# EAGLE schematic M1502C (EAGLE 6.6.0)
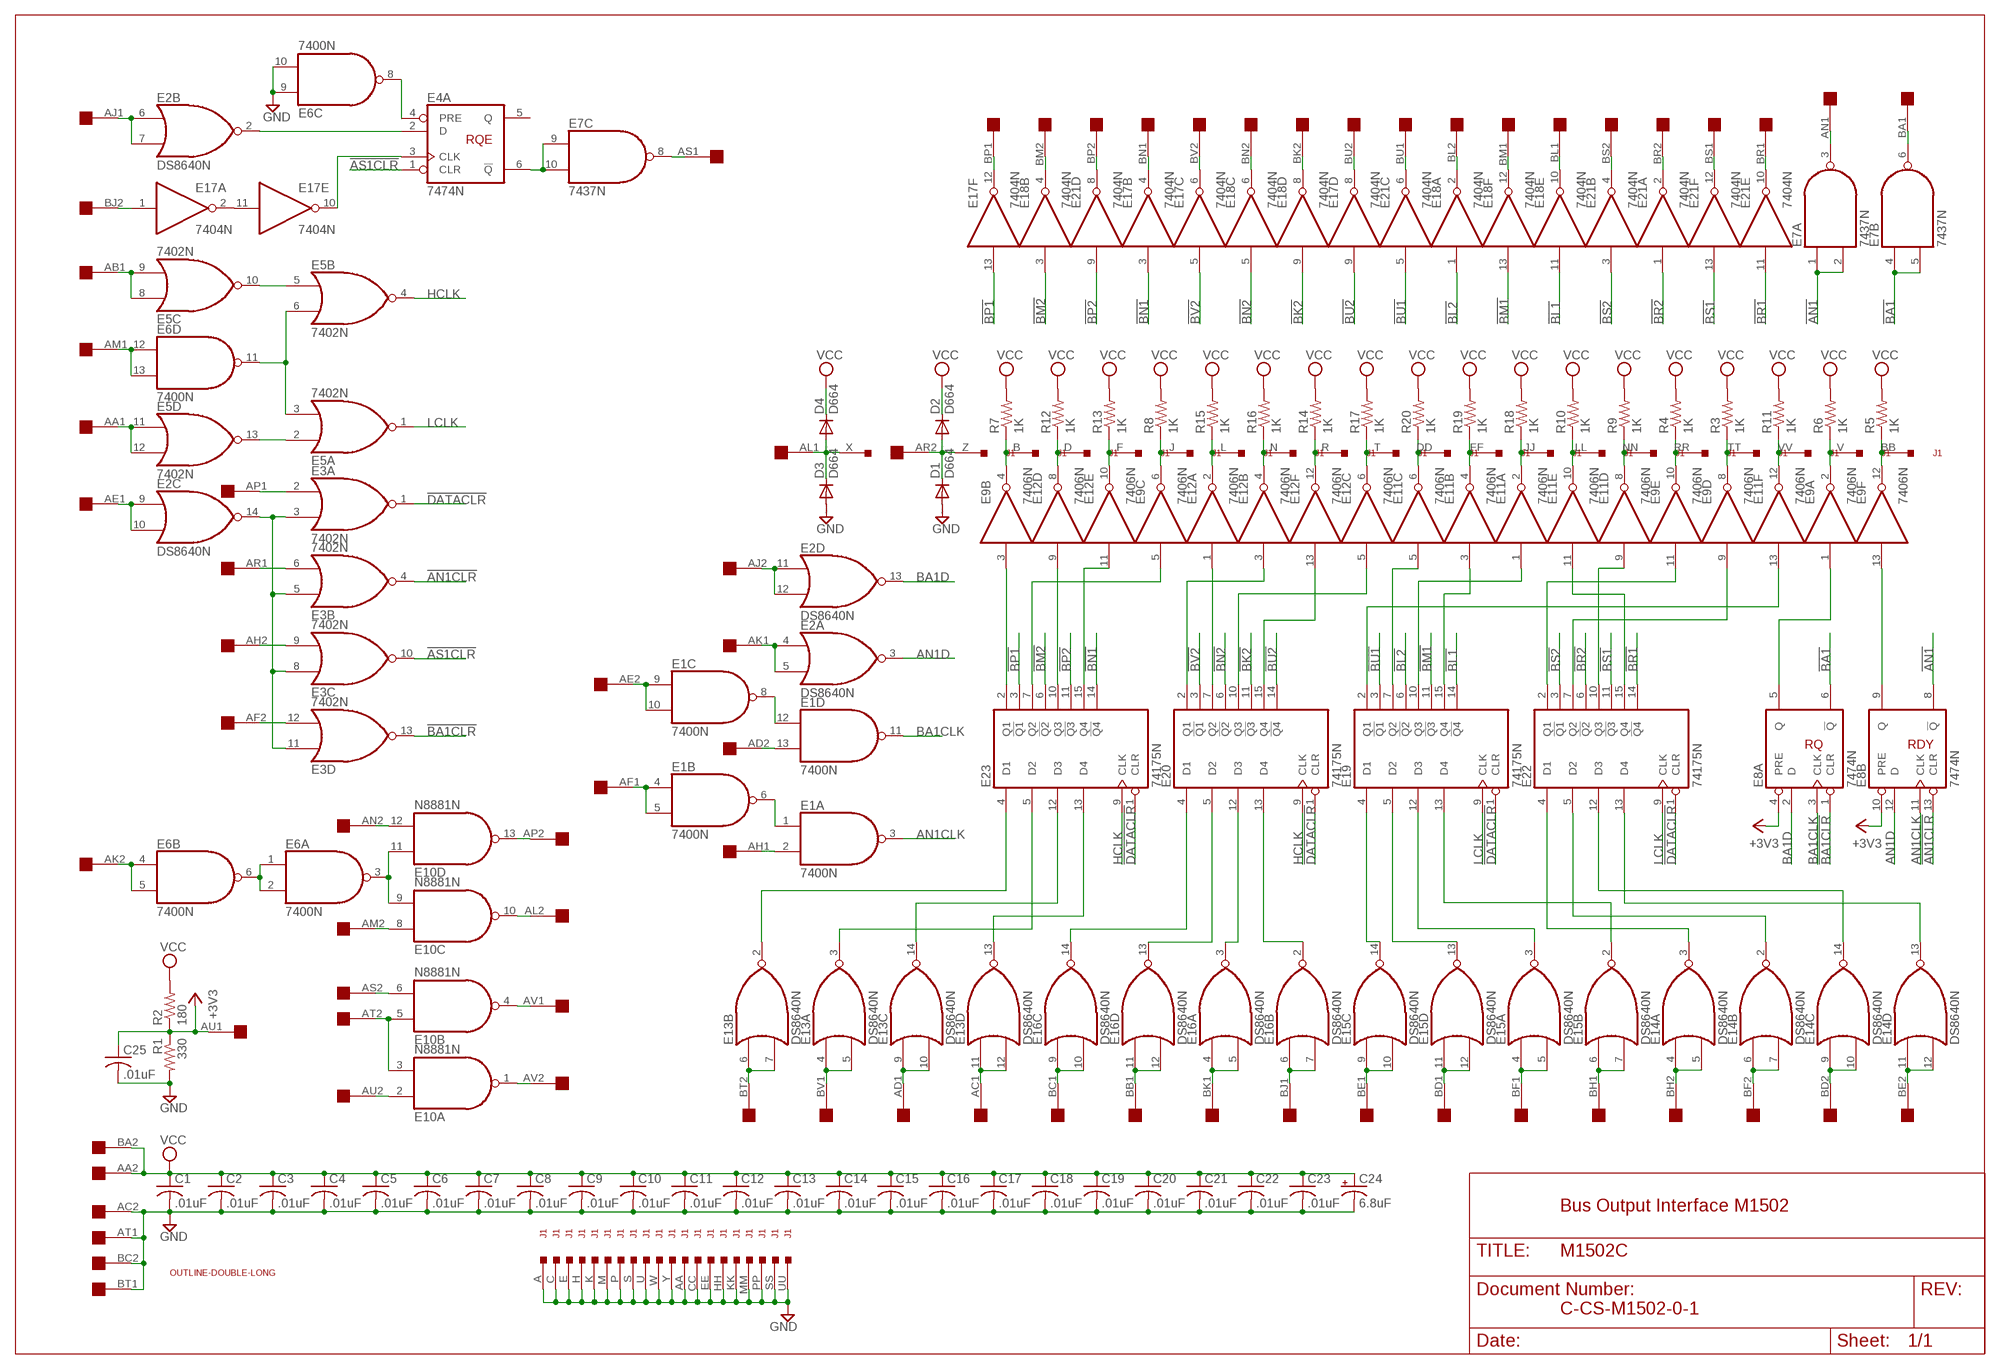
[diagram p0: schematic, sheet 1]

## Parts
C1  .01uF  C-US075-032X103  [C075-032X103]
C2  .01uF  C-US075-032X103  [C075-032X103]
C3  .01uF  C-US075-032X103  [C075-032X103]
C4  .01uF  C-US075-032X103  [C075-032X103]
C5  .01uF  C-US075-032X103  [C075-032X103]
C6  .01uF  C-US075-032X103  [C075-032X103]
C7  .01uF  C-US075-032X103  [C075-032X103]
C8  .01uF  C-US075-032X103  [C075-032X103]
C9  .01uF  C-US075-032X103  [C075-032X103]
C10  .01uF  C-US075-032X103  [C075-032X103]
C11  .01uF  C-US075-032X103  [C075-032X103]
C12  .01uF  C-US075-032X103  [C075-032X103]
C13  .01uF  C-US075-032X103  [C075-032X103]
C14  .01uF  C-US075-032X103  [C075-032X103]
C15  .01uF  C-US075-032X103  [C075-032X103]
C16  .01uF  C-US075-032X103  [C075-032X103]
C17  .01uF  C-US075-032X103  [C075-032X103]
C18  .01uF  C-US075-032X103  [C075-032X103]
C19  .01uF  C-US075-032X103  [C075-032X103]
C20  .01uF  C-US075-032X103  [C075-032X103]
C21  .01uF  C-US075-032X103  [C075-032X103]
C22  .01uF  C-US075-032X103  [C075-032X103]
C23  .01uF  C-US075-032X103  [C075-032X103]
C24  6.8uF  CPOL-USE20-8AXIAL  [E12-8]
C25  .01uF  C-US075-032X103  [C075-032X103]
D1  D664  DIODE-DO35-10  [DO35-10]
D2  D664  DIODE-DO35-10  [DO35-10]
D3  D664  DIODE-DO35-10  [DO35-10]
D4  D664  DIODE-DO35-10  [DO35-10]
E1  7400N  [DIL14]
E2  DS8640N  [DIL14]
E3  7402N  [DIL14]
E4  7474N  74S74N  [DIL14]
E5  7402N  [DIL14]
E6  7400N  [DIL14]
E7  7437N  [DIL14]
E8  7474N  74S74N  [DIL14]
E9  7406N  [DIL14]
E10  N8881N  [DIL14]
E11  7406N  [DIL14]
E12  7406N  [DIL14]
E13  DS8640N  [DIL14]
E14  DS8640N  [DIL14]
E15  DS8640N  [DIL14]
E16  DS8640N  [DIL14]
E17  7404N  [DIL14]
E18  7404N  [DIL14]
E19  74175N  [DIL16]
E20  74175N  [DIL16]
E21  7404N  [DIL14]
E22  74175N  [DIL16]
E23  74175N  [DIL16]
J1  DEC40PINSH  [DEC40PINH]
R1  330  R-US_0207/10  [0207/10]
R2  180  R-US_0207/10  [0207/10]
R3  1K  R-US_0207/10  [0207/10]
R4  1K  R-US_0207/10  [0207/10]
R5  1K  R-US_0207/10  [0207/10]
R6  1K  R-US_0207/10  [0207/10]
R7  1K  R-US_0207/10  [0207/10]
R8  1K  R-US_0207/10  [0207/10]
R9  1K  R-US_0207/10  [0207/10]
R10  1K  R-US_0207/10  [0207/10]
R11  1K  R-US_0207/10  [0207/10]
R12  1K  R-US_0207/10  [0207/10]
R13  1K  R-US_0207/10  [0207/10]
R14  1K  R-US_0207/10  [0207/10]
R15  1K  R-US_0207/10  [0207/10]
R16  1K  R-US_0207/10  [0207/10]
R17  1K  R-US_0207/10  [0207/10]
R18  1K  R-US_0207/10  [0207/10]
R19  1K  R-US_0207/10  [0207/10]
R20  1K  R-US_0207/10  [0207/10]
U$1  OUTLINE-DOUBLE-LONG  [DOUBLE-LONG]
U$3  DOUBLE  [EDGE-CON4]

## Nets
!AN1: E7.1(A:I0) E7.2(A:I1) E8.8(B:!Q)
!AN1CLR: E3.4(B:O) E8.13(B:CLR)
!AS1CLR: E3.10(C:O) E4.1(A:CLR)
!BA1: E7.4(B:I0) E7.5(B:I1) E8.6(A:!Q)
!BA1CLR: E3.13(D:O) E8.1(A:CLR)
!BK2: E18.9(D:I) E20.11(!Q3)
!BL1: E18.11(E:I) E19.14(!Q4)
!BL2: E18.1(A:I) E19.6(!Q2)
!BM1: E18.13(F:I) E19.11(!Q3)
!BM2: E18.3(B:I) E23.6(!Q2)
!BN1: E17.3(B:I) E23.14(!Q4)
!BN2: E18.5(C:I) E20.6(!Q2)
!BP1: E17.13(F:I) E23.3(!Q1)
!BP2: E21.9(D:I) E23.11(!Q3)
!BR1: E21.11(E:I) E22.14(!Q4)
!BR2: E21.1(A:I) E22.6(!Q2)
!BS1: E21.13(F:I) E22.11(!Q3)
!BS2: E21.3(B:I) E22.3(!Q1)
!BU1: E19.3(!Q1) E21.5(C:I)
!BU2: E17.9(D:I) E20.14(!Q4)
!BV2: E17.5(C:I) E20.3(!Q1)
!DATACLR: E3.1(A:O) E19.1(CLR) E20.1(CLR) E22.1(CLR) E23.1(CLR)
+3V: E4.4(A:PRE) E6.8(C:O)
+3V3 [supply]: C25.1 E8.4(A:PRE) E8.10(B:PRE) R1.1 R2.1 U$3.AU1
AA1: E5.11(D:I0) E5.12(D:I1) U$3.AA1
AB1: E5.8(C:I0) E5.9(C:I1) U$3.AB1
AC1: E13.11(D:I0) E13.12(D:I1) U$3.AC1
AD1: E13.9(C:I0) E13.10(C:I1) U$3.AD1
AD2: E1.13(D:I1) U$3.AD2
AE1: E2.9(C:I0) E2.10(C:I1) U$3.AE1
AE2: E1.9(C:I0) E1.10(C:I1) U$3.AE2
AF1: E1.4(B:I0) E1.5(B:I1) U$3.AF1
AF2: E3.12(D:I1) U$3.AF2
AH1: E1.2(A:I1) U$3.AH1
AH2: E3.9(C:I1) U$3.AH2
AJ1: E2.6(B:I0) E2.7(B:I1) U$3.AJ1
AJ2: E2.11(D:I0) E2.12(D:I1) U$3.AJ2
AK1: E2.4(A:I0) E2.5(A:I1) U$3.AK1
AK2: E6.4(B:I0) E6.5(B:I1) U$3.AK2
AL2: E10.10(C:O) U$3.AL2
AM1: E6.12(D:I0) E6.13(D:I1) U$3.AM1
AM2: E10.8(C:I0) U$3.AM2
AN1: E7.3(A:O) U$3.AN1
AN1CLK: E1.3(A:O) E8.11(B:CLK)
AN1D: E2.3(A:O) E8.12(B:D)
AN2: E10.12(D:I1) U$3.AN2
AP1: E3.2(A:I0) U$3.AP1
AP2: E10.13(D:O) U$3.AP2
AR1: E3.6(B:I1) U$3.AR1
AS1: E7.8(C:O) U$3.AS1
AS2: E10.6(B:I1) U$3.AS2
AT2: E10.3(A:I1) E10.5(B:I0) U$3.AT2
AU2: E10.2(A:I0) U$3.AU2
AV1: E10.4(B:O) U$3.AV1
AV2: E10.1(A:O) U$3.AV2
B: E9.4(B:O) J1.B R7.1
BA1: E7.6(B:O) U$3.BA1
BA1CLK: E1.11(D:O) E8.3(A:CLK)
BA1D: E2.13(D:O) E8.2(A:D)
BB: E9.12(F:O) J1.BB R5.1
BB1: E16.11(D:I0) E16.12(D:I1) U$3.BB1
BC1: E16.9(C:I0) E16.10(C:I1) U$3.BC1
BD1: E15.11(D:I0) E15.12(D:I1) U$3.BD1
BD2: E14.9(C:I0) E14.10(C:I1) U$3.BD2
BE1: E15.9(C:I0) E15.10(C:I1) U$3.BE1
BE2: E14.11(D:I0) E14.12(D:I1) U$3.BE2
BF1: E15.4(A:I0) E15.5(A:I1) U$3.BF1
BF2: E14.6(B:I0) E14.7(B:I1) U$3.BF2
BH1: E15.6(B:I0) E15.7(B:I1) U$3.BH1
BH2: E14.4(A:I0) E14.5(A:I1) U$3.BH2
BJ1: E16.6(B:I0) E16.7(B:I1) U$3.BJ1
BJ2: E17.1(A:I) U$3.BJ2
BK1: E16.4(A:I0) E16.5(A:I1) U$3.BK1
BK2: E18.8(D:O) U$3.BK2
BL1: E18.10(E:O) U$3.BL1
BL2: E18.2(A:O) U$3.BL2
BM1: E18.12(F:O) U$3.BM1
BM2: E18.4(B:O) U$3.BM2
BN1: E17.4(B:O) U$3.BN1
BN2: E18.6(C:O) U$3.BN2
BP1: E17.12(F:O) U$3.BP1
BP2: E21.8(D:O) U$3.BP2
BR1: E21.10(E:O) U$3.BR1
BR2: E21.2(A:O) U$3.BR2
BS1: E21.12(F:O) U$3.BS1
BS2: E21.4(B:O) U$3.BS2
BT2: E13.6(B:I0) E13.7(B:I1) U$3.BT2
BU1: E21.6(C:O) U$3.BU1
BU2: E17.8(D:O) U$3.BU2
BV1: E13.4(A:I0) E13.5(A:I1) U$3.BV1
BV2: E17.6(C:O) U$3.BV2
D: E12.8(D:O) J1.D R12.1
DD: E11.6(C:O) J1.DD R20.1
F: E12.10(E:O) J1.F R13.1
FF: E11.4(B:O) J1.FF R19.1
GND [supply]: C1.2 C2.2 C3.2 C4.2 C5.2 C6.2 C7.2 C8.2 C9.2 C10.2 C11.2 C12.2 C13.2 C14.2 C15.2 C16.2 C17.2 C18.2 C19.2 C20.2 C21.2 C22.2 C23.2 C24.- C25.2 D1.A D3.A E6.9(C:I0) E6.10(C:I1) J1.A J1.AA J1.C J1.CC J1.E J1.EE J1.H J1.HH J1.K J1.KK J1.M J1.MM J1.P J1.PP J1.S J1.SS J1.U J1.UU J1.W J1.Y R1.2 U$3.AC2 U$3.AT1 U$3.BC2 U$3.BT1
HCLK: E5.4(B:O) E20.9(CLK) E23.9(CLK)
J: E9.6(C:O) J1.J R8.1
JJ: E11.2(A:O) J1.JJ R18.1
L: E12.2(A:O) J1.L R15.1
LCLK: E5.1(A:O) E19.9(CLK) E22.9(CLK)
LL: E11.10(E:O) J1.LL R10.1
N: E12.4(B:O) J1.N R16.1
N$8: E2.14(C:O) E3.3(A:I1) E3.5(B:I0) E3.8(C:I0) E3.11(D:I0)
N$15: E5.3(A:I1) E5.6(B:I1) E6.11(D:O)
N$16: E5.2(A:I0) E5.13(D:O)
N$23: E5.5(B:I0) E5.10(C:O)
N$25: E1.8(C:O) E1.12(D:I0)
N$36: E1.1(A:I0) E1.6(B:O)
N$40: E2.2(B:O) E4.2(A:D)
N$49: E4.3(A:CLK) E17.10(E:O)
N$56: E4.6(A:!Q) E7.9(C:I0) E7.10(C:I1)
N$62: E6.1(A:I0) E6.2(A:I1) E6.6(B:O)
N$68: E6.3(A:O) E10.9(C:I1) E10.11(D:I0)
N$89: E8.5(A:Q) E9.1(A:I)
N$90: E8.9(B:Q) E9.13(F:I)
N$98: E9.9(D:I) E22.7(Q2)
N$99: E9.5(C:I) E23.7(Q2)
N$100: E9.3(B:I) E23.2(Q1)
N$102: E9.11(E:I) E22.2(Q1)
N$108: E11.1(A:I) E19.10(Q3)
N$109: E11.13(F:I) E19.2(Q1)
N$110: E11.9(D:I) E22.10(Q3)
N$111: E11.5(C:I) E19.7(Q2)
N$112: E11.3(B:I) E19.15(Q4)
N$113: E11.11(E:I) E22.15(Q4)
N$120: E12.1(A:I) E20.7(Q2)
N$121: E12.13(F:I) E20.15(Q4)
N$122: E12.9(D:I) E23.10(Q3)
N$123: E12.5(C:I) E20.10(Q3)
N$124: E12.3(B:I) E20.2(Q1)
N$125: E12.11(E:I) E23.15(Q4)
N$132: E13.3(A:O) E23.5(D2)
N$133: E13.13(D:O) E23.13(D4)
N$134: E13.14(C:O) E23.12(D3)
N$135: E13.2(B:O) E23.4(D1)
N$156: E14.3(A:O) E22.4(D1)
N$157: E14.13(D:O) E22.13(D4)
N$158: E14.14(C:O) E22.12(D3)
N$159: E14.2(B:O) E22.5(D2)
N$168: E15.3(A:O) E19.12(D3)
N$169: E15.13(D:O) E19.5(D2)
N$170: E15.14(C:O) E19.4(D1)
N$171: E15.2(B:O) E19.13(D4)
N$180: E16.3(A:O) E20.12(D3)
N$181: E16.13(D:O) E20.5(D2)
N$182: E16.14(C:O) E20.4(D1)
N$183: E16.2(B:O) E20.13(D4)
N$194: E17.2(A:O) E17.11(E:I)
NN: E11.8(D:O) J1.NN R9.1
R: E12.12(F:O) J1.R R14.1
RR: E9.10(E:O) J1.RR R4.1
T: E12.6(C:O) J1.T R17.1
TT: E9.8(D:O) J1.TT R3.1
V: E9.2(A:O) J1.V R6.1
VCC [supply]: C1.1 C2.1 C3.1 C4.1 C5.1 C6.1 C7.1 C8.1 C9.1 C10.1 C11.1 C12.1 C13.1 C14.1 C15.1 C16.1 C17.1 C18.1 C19.1 C20.1 C21.1 C22.1 C23.1 C24.+ D2.C D4.C R2.2 R3.2 R4.2 R5.2 R6.2 R7.2 R8.2 R9.2 R10.2 R11.2 R12.2 R13.2 R14.2 R15.2 R16.2 R17.2 R18.2 R19.2 R20.2 U$3.AA2 U$3.BA2
VV: E11.12(F:O) J1.VV R11.1
X: D3.C D4.A J1.X U$3.AL1
Z: D1.C D2.A J1.Z U$3.AR2
Unconnected: E4.5(A:Q) E4.8(B:!Q) E4.9(B:Q) E4.10(B:PRE) E4.11(B:CLK) E4.12(B:D) E4.13(B:CLR) E7.11(D:O) E7.12(D:I0) E7.13(D:I1) U$3.AB2 U$3.BB2

## Notes on the sheet
- RQE
- RQ | RDY
- Bus Output Interface M1502
- C-CS-M1502-0-1

## Power pins joined to a net without a drawn wire
GND: E1.7(P:GND) E2.1(P:GND) E3.7(P:GND) E4.7(P:GND) E5.7(P:GND) E6.7(P:GND) E7.7(P:GND) E8.7(P:GND) E9.7(P:GND) E10.7(P:GND) E11.7(P:GND) E12.7(P:GND) E13.1(P:GND) E14.1(P:GND) E15.1(P:GND) E16.1(P:GND) E17.7(P:GND) E18.7(P:GND) E19.8(GND) E20.8(GND) E21.7(P:GND) E22.8(GND) E23.8(GND)
VCC: E1.14(P:VCC) E2.8(P:VCC) E3.14(P:VCC) E4.14(P:VCC) E5.14(P:VCC) E6.14(P:VCC) E7.14(P:VCC) E8.14(P:VCC) E9.14(P:VCC) E10.14(P:VCC) E11.14(P:VCC) E12.14(P:VCC) E13.8(P:VCC) E14.8(P:VCC) E15.8(P:VCC) E16.8(P:VCC) E17.14(P:VCC) E18.14(P:VCC) E19.16(VCC) E20.16(VCC) E21.14(P:VCC) E22.16(VCC) E23.16(VCC)

## Library data of the parts
C1-C23 C25 = rcl:C-US: CAPACITOR, American symbol
C24 = dec-con:CPOL-USE20-8AXIAL: A 0.8 inch electrolytic.
D1-D4 = diode:DIODE-: DIODE
E1 E6 = 74xx-us:74*00: Quad 2-input NAND gate
E2 E13-E16 = dec-con:DS8640: Quad NOR gate
E3 E5 = 74xx-us:74*02: Quad 2-input NOR gate
E4 E8 = 74xx-us:74*74: Dual D type positive edge triggered FLIP FLOP, preset and clear
E7 = 74xx-us:74*37: Quad 2-input NAND buffer
E9 E11 E12 = 74xx-us:74*06: Hex INVERTER, open collector high-voltage output
E10 = dec-con:N8881: Quad 2-input NAND gate, open collector
E17 E18 E21 = 74xx-us:74*04: Hex INVERTER
E19 E20 E22 E23 = 74xx-us:74*175: Qadruple D type FLIP FLOP, clear
J1 = dec-con:DEC40PINS: 40 pin ribbon connector for BC08, BC11 cables.
R1-R20 = rcl:R-US_: RESISTOR, American symbol
U$1 = dec-con:OUTLINE-*: Board outlines for DEC boards.
U$3 = dec-con:DOUBLE: Double-Height DEC board

## Net classes
1 supply: width 0.813 mm